# Altium project RT5621 Main V3.2.PrjPcb
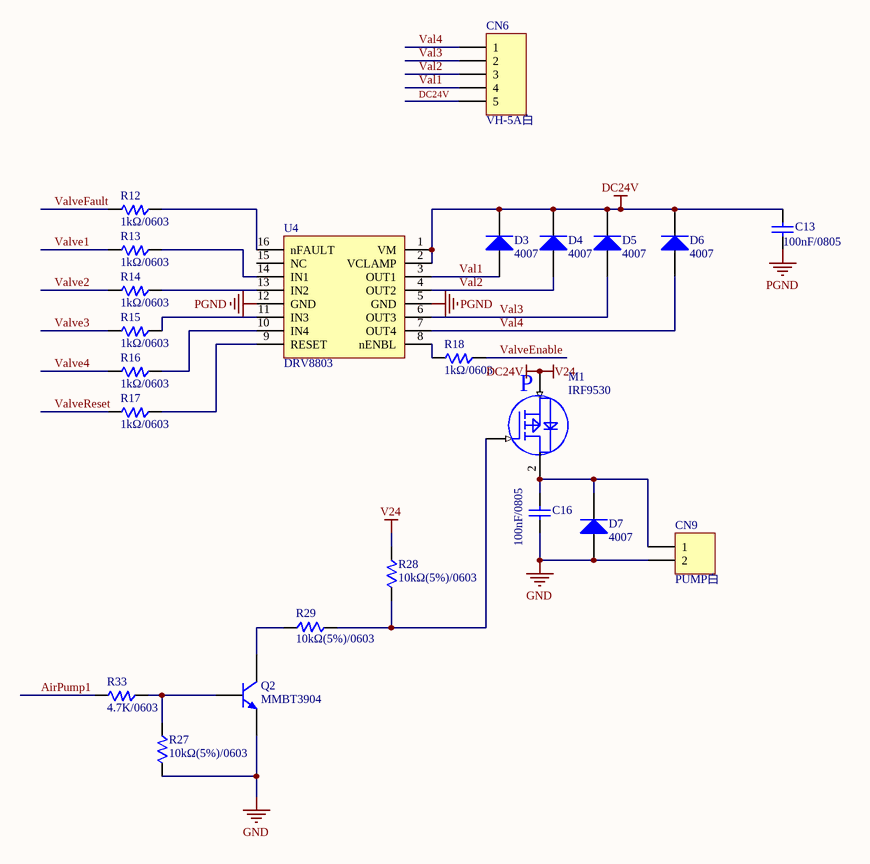
[diagram p0: RT-ValveX4+AirPump.SchDoc]
5 sheets, 130 parts. Net scope: global (net labels, ports and power ports of the same name join across sheets).
Board file: RT5621 Main V3.3.PcbDoc
Sheets:
  RT-ValveX4+AirPump.SchDoc
  RT-HOT.SchDoc
  Motor.SchDoc
  RT-TI DC-DC 5V-LMR14030.SchDoc
  RT5621 Main V3.3.SchDoc

## Sheet RT-ValveX4+AirPump.SchDoc
size A4

### Parts
C13  100nF/0805  [0805C]
C16  100nF/0805  [0805C]
CN6  VH-5A白  [CON-VH-5P]
CN9  PUMP白  [CON-VH-2P]
D3  4007  [DO-214AC]
D4  4007  [DO-214AC]
D5  4007  [DO-214AC]
D6  4007  [DO-214AC]
D7  4007  [DO-214AC]
M1  IRF9530  [TO-220AB]
Q2  MMBT3904  [SOT-23-N]
R12  1kΩ/0603  [0603]
R13  1kΩ/0603  [0603]
R14  1kΩ/0603  [0603]
R15  1kΩ/0603  [0603]
R16  1kΩ/0603  [0603]
R17  1kΩ/0603  [0603]
R18  1kΩ/0603  [0603]
R27  10kΩ(5%)/0603  [0603]
R28  10kΩ(5%)/0603  [0603]
R29  10kΩ(5%)/0603  [0603]
R33  4.7K/0603  [0603]
U4  DRV8803  [PWP16]

### Nets
DC24V: C13.2 CN6.5 D3.2(K) D4.2(K) D5.2(K) D6.2(K) M1.3(D) R28.2 U4.1(VM) U4.2(VCLAMP)  [also labelled V24]
GND: C13.1 C16.1 CN9.2 D7.1(A) Q2.E R27.1 U4.5(GND) U4.12(GND)  [also labelled PGND]
AirPump1: R33.1
Val1: CN6.4 D3.1(A) U4.3(OUT1)
Val2: CN6.3 D4.1(A) U4.4(OUT2)
Val3: CN6.2 D5.1(A) U4.6(OUT3)
Val4: CN6.1 D6.1(A) U4.7(OUT4)
Valve1: R13.1
Valve2: R14.1
Valve3: R15.1
Valve4: R16.1
ValveEnable: R18.2
ValveFault: R12.1
ValveReset: R17.1
NetC16_2: C16.2 CN9.1 D7.2(K) M1.2(S)
NetM1_1: M1.1(G) R28.1 R29.1
NetQ2_B: Q2.B R27.2 R33.2
NetQ2_C: Q2.C R29.2
NetR12_2: R12.2 U4.16(nFAULT)
NetR13_2: R13.2 U4.14(IN1)
NetR14_2: R14.2 U4.13(IN2)
NetR15_2: R15.2 U4.11(IN3)
NetR16_2: R16.2 U4.10(IN4)
NetR17_2: R17.2 U4.9(RESET)
NetR18_1: R18.1 U4.8(nENBL)

Not connected (* = marked no-connect by the designer): U4 15(NC)

### Notes on the sheet
- 上海荣泰健康科技股份有限公司
- 设计
- 评审
- 审核
- 版本
- 日期
- (in symbol MP-IRF9530/环保) P

### Library data of the parts
C13 C16 = C0805/104M: 物料名称: 贴片电容104M/50V/0805封装/20%/X7R/环保; 物料编号: 1.01.25.003; 领料单位: 电子车间; 单位: 个; 仓库/库位: 内5X
CN6 = CON-VH-5A(白色): 物料名称: 大直脚VH-5A(白色)/环保; 物料编号: 1.01.57.524; 领料单位: 电子车间; 单位: 个; 仓库/库位: 内5X
CN9 = CON-VH-2A(白色): 物料名称: 大直脚VH-2A(白色)/环保; 物料编号: 1.01.57.500; 领料单位: 电子车间; 单位: 个; 仓库/库位: 内5X
D3-D7 = D4007/M7: 物料名称: 贴片二极管M7A/A-SMA封装/环保; 物料编号: 1.01.33.005; 领料单位: 电子车间; 单位: 个; 仓库/库位: 内5X
M1 = MP-IRF9530/环保: 物料名称: 场效应管(MOS管)IRF9530/环保; 物料编号: 1.01.40.003; 领料单位: 电子车间; 单位: 个; 仓库/库位: 内5X
Q2 = Q-MMBT3904/1AM-N: 物料名称: 贴片三极管1AM/MMBT3904/sot-23封装环保; 物料编号: 1.01.33.013; 领料单位: 电子车间; 单位: 个; 仓库/库位: 内5X
R12-R18 = R0603/1kΩ: 物料编号: 1.01.15.111; 物料名称: 贴片电阻1K/(5%)/0603封装/环保; 领料单位: 电子车间; 单位: 个; 仓库/库位: 内5X
R27-R29 = R0603/10kΩ/(5%): 物料编号: 1.01.15.105; 物料名称: 贴片电阻10kΩ/(5%)0603封装/环保; 领料单位: 个; 仓库/库位: 内5X
R33 = R0603/4.7K/(5%): 物料编号: 1.01.15.115; 物料名称: 贴片电阻4.7K/(5%)/0603封装/环保; 领料单位: 电子车间; 单位: 个; 仓库/库位: 内5X
U4 = IC-DRV8803: 物料名称: PWM输入4通道低侧驱动器DRV8803; 物料编号: 1.01.45.544; 领料单位: 电子车间; 单位: 个; 仓库/库位: 内5X

## Sheet RT-HOT.SchDoc
size A4
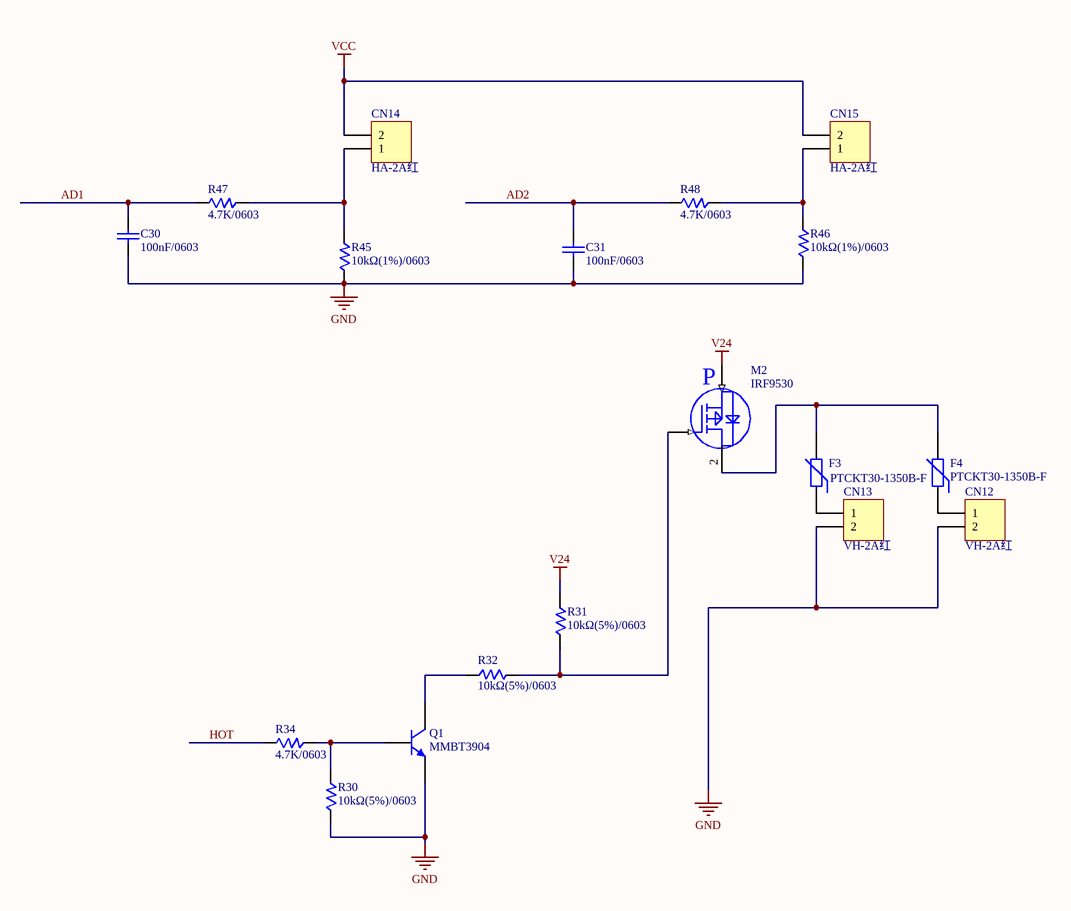
[diagram p1: RT-HOT.SchDoc]

### Parts
C30  100nF/0603  [0603C]
C31  100nF/0603  [0603C]
CN12  VH-2A红  [CON-VH-2P]
CN13  VH-2A红  [CON-VH-2P]
CN14  HA-2A红  [CON-XA-2P]
CN15  HA-2A红  [CON-XA-2P]
F3  PTCKT30-1350B-F  [FRAD0.2]
F4  PTCKT30-1350B-F  [FRAD0.2]
M2  IRF9530  [TO-220AB]
Q1  MMBT3904  [SOT-23-N]
R30  10kΩ(5%)/0603  [0603]
R31  10kΩ(5%)/0603  [0603]
R32  10kΩ(5%)/0603  [0603]
R34  4.7K/0603  [0603]
R45  10kΩ(1%)/0603  [0603]
R46  10kΩ(1%)/0603  [0603]
R47  4.7K/0603  [0603]
R48  4.7K/0603  [0603]

### Nets
GND: C30.2 C31.2 CN12.2 CN13.2 Q1.E R30.1 R45.1 R46.1
V24: M2.3(D) R31.2  [project net DC24V]
VCC: CN14.2 CN15.2
AD1: C30.1 R47.1
AD2: C31.1 R48.1
HOT: R34.1
NetCN12_1: CN12.1 F4.1
NetCN13_1: CN13.1 F3.1
NetCN14_1: CN14.1 R45.2 R47.2
NetCN15_1: CN15.1 R46.2 R48.2
NetF3_2: F3.2 F4.2 M2.2(S)
NetM2_1: M2.1(G) R31.1 R32.1
NetQ1_B: Q1.B R30.2 R34.2
NetQ1_C: Q1.C R32.2

### Notes on the sheet
- (in symbol MP-IRF9530/环保) P

### Library data of the parts
C30 C31 = C0603/100nF: 物料名称: 贴片电容104M/(20%)/X7R/0603封装/环保; 物料编号: 1.01.25.056; 领料单位: 电子车间; 单位: 个; 仓库/库位: 内5X
CN12 CN13 = CON-VH-2A(红色): 物料名称: 大直脚VH-2A(红色)/环保; 物料编号: 1.01.57.502; 领料单位: 电子车间; 单位: 个; 仓库/库位: 内5X
CN14 CN15 = CON-HA-2A(红色): 物料名称: 带勾小直角HA-2A(红色）/环保; 物料编号: 1.01.57.928; 领料单位: 电子车间; 单位: 个; 仓库/库位: 内5X
F3 F4 = F-PTCKT30-1350B-F/环保: 物料名称: 自恢复保险PTCKT30-1350b-F/环保; 物料编号: 1.01.38.609; 领料单位: 电子车间; 单位: 个; 仓库/库位: 内5X
M2 = MP-IRF9530/环保: as M1 on sheet RT-ValveX4+AirPump
Q1 = Q-MMBT3904/1AM-N: as Q2 on sheet RT-ValveX4+AirPump
R30-R32 = R0603/10kΩ/(5%): as R27 on sheet RT-ValveX4+AirPump
R34 R47 R48 = R0603/4.7K/(5%): as R33 on sheet RT-ValveX4+AirPump
R45 R46 = R0603/10kΩ(1%): 物料编号: 1.01.15.112; 物料名称: 贴片电阻10kΩ(1%)/0603封装/环保; 领料单位: 电子车间; 单位: 个; 仓库/库位: 内5X

## Sheet Motor.SchDoc
size A4
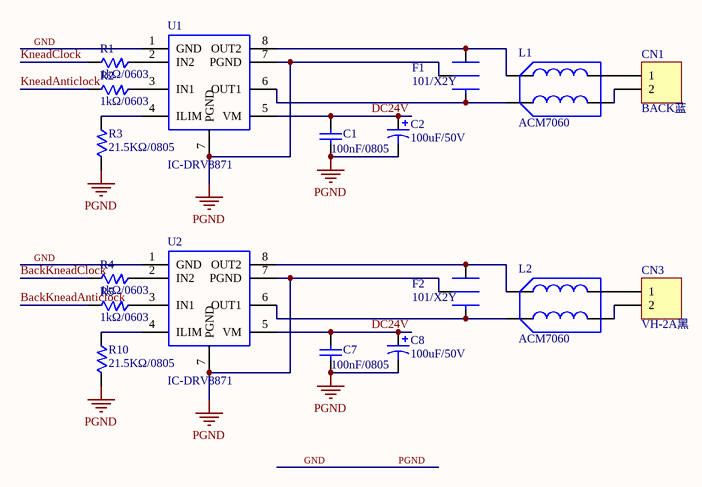
[diagram p2: Motor.SchDoc]

### Parts
C1  100nF/0805  [0805C]
C2  100uF/50V  [RB.15/.35]
C7  100nF/0805  [0805C]
C8  100uF/50V  [RB.15/.35]
CN1  BACK蓝  [CON-VH-2P]
CN3  VH-2A黑  [CON-VH-2P]
F1  101/X2Y  [X2Y]
F2  101/X2Y  [X2Y]
L1  ACM7060  [TLDCM7161]
L2  ACM7060  [TLDCM7161]
R1  1kΩ/0603  [0603]
R2  1kΩ/0603  [0603]
R3  21.5KΩ/0805  [0603]
R4  1kΩ/0603  [0603]
R5  1kΩ/0603  [0603]
R10  21.5KΩ/0805  [0603]
U1  IC-DRV8871  [DRV8871]
U2  IC-DRV8871  [DRV8871]

### Nets
DC24V: C1.2 C2.1 C7.2 C8.1 U1.5(VM) U2.5(VM)
GND: C1.1 C2.2 C7.1 C8.2 F1.3 F2.3 R3.1 R10.1 U1.1(GND) U1.7(PGND) U2.1(GND) U2.7(PGND)  [also labelled PGND]
BackKneadAnticlock: R5.1
BackKneadClock: R4.1
KneadAnticlock: R2.1
KneadClock: R1.1
NetCN1_1: CN1.1 L1.3
NetCN1_2: CN1.2 L1.4
NetCN3_1: CN3.1 L2.3
NetCN3_2: CN3.2 L2.4
NetF1_1: F1.1 L1.2 U1.8(OUT2)
NetF1_2: F1.2 L1.1 U1.6(OUT1)
NetF2_1: F2.1 L2.2 U2.8(OUT2)
NetF2_2: F2.2 L2.1 U2.6(OUT1)
NetR1_2: R1.2 U1.2(IN2)
NetR2_2: R2.2 U1.3(IN1)
NetR3_2: R3.2 U1.4(ILIM)
NetR4_2: R4.2 U2.2(IN2)
NetR5_2: R5.2 U2.3(IN1)
NetR10_2: R10.2 U2.4(ILIM)

### Notes on the sheet
- 上海荣泰健康科技股份有限公司
- 设计
- 评审
- 审核
- 版本
- 日期

### Library data of the parts
C1 C7 = C0805/104M: as C13 on sheet RT-ValveX4+AirPump
C2 C8 = CD/100uF/50V: 物料名称: 电解电容100uF/50V/8*11/编带/环保; 物料编号: 1.01.21.024; 领料单位: 电子车间; 单位: 个; 仓库/库位: 内5X
CN1 = CON-VH-2A(蓝色): 物料名称: 大直脚VH-2A(蓝色)/环保; 物料编号: 1.01.57.504; 领料单位: 电子车间; 单位: 个; 仓库/库位: 内5X
CN3 = CON-VH-2A(黑色): 物料名称: 大直脚VH-2A(黑色)/环保; 物料编号: 1.01.57.503; 领料单位: 电子车间; 单位: 个; 仓库/库位: 内5X
F1 F2 = CX2Y/101: 物料名称: X2Y电容/101X15W103MV4E/环保; 物料编号: 1.01.51.073; 领料单位: 电子车间; 单位: 个; 仓库/库位: 内5X
L1 L2 = L/ACM7060: 物料名称: 贴片共模电感/ACM7060-701-2PL-TL-01/7060封装/环保; 物料编号: 1.01.51.077; 领料单位: 电子车间; 单位: 个; 仓库/库位: 内5X
R1 R2 R4 R5 = R0603/1kΩ: as R12 on sheet RT-ValveX4+AirPump
R3 R10 = R0603/21.5KΩ 1%: 物料编号: 新物料; 物料名称: 贴片电阻21.5KΩ/0603封装/精度1%/环保; 领料单位: 电子车间; 仓库/库位: 内5X
U1 U2 = IC-DRV8871: 物料名称: 电机H型驱动芯片/DRV8871; 物料编号: 1.01.45.595; 领料单位: 电子车间; 单位: 个; 仓库/库位: 内5X

## Sheet RT-TI DC-DC 5V-LMR14030.SchDoc
size A4
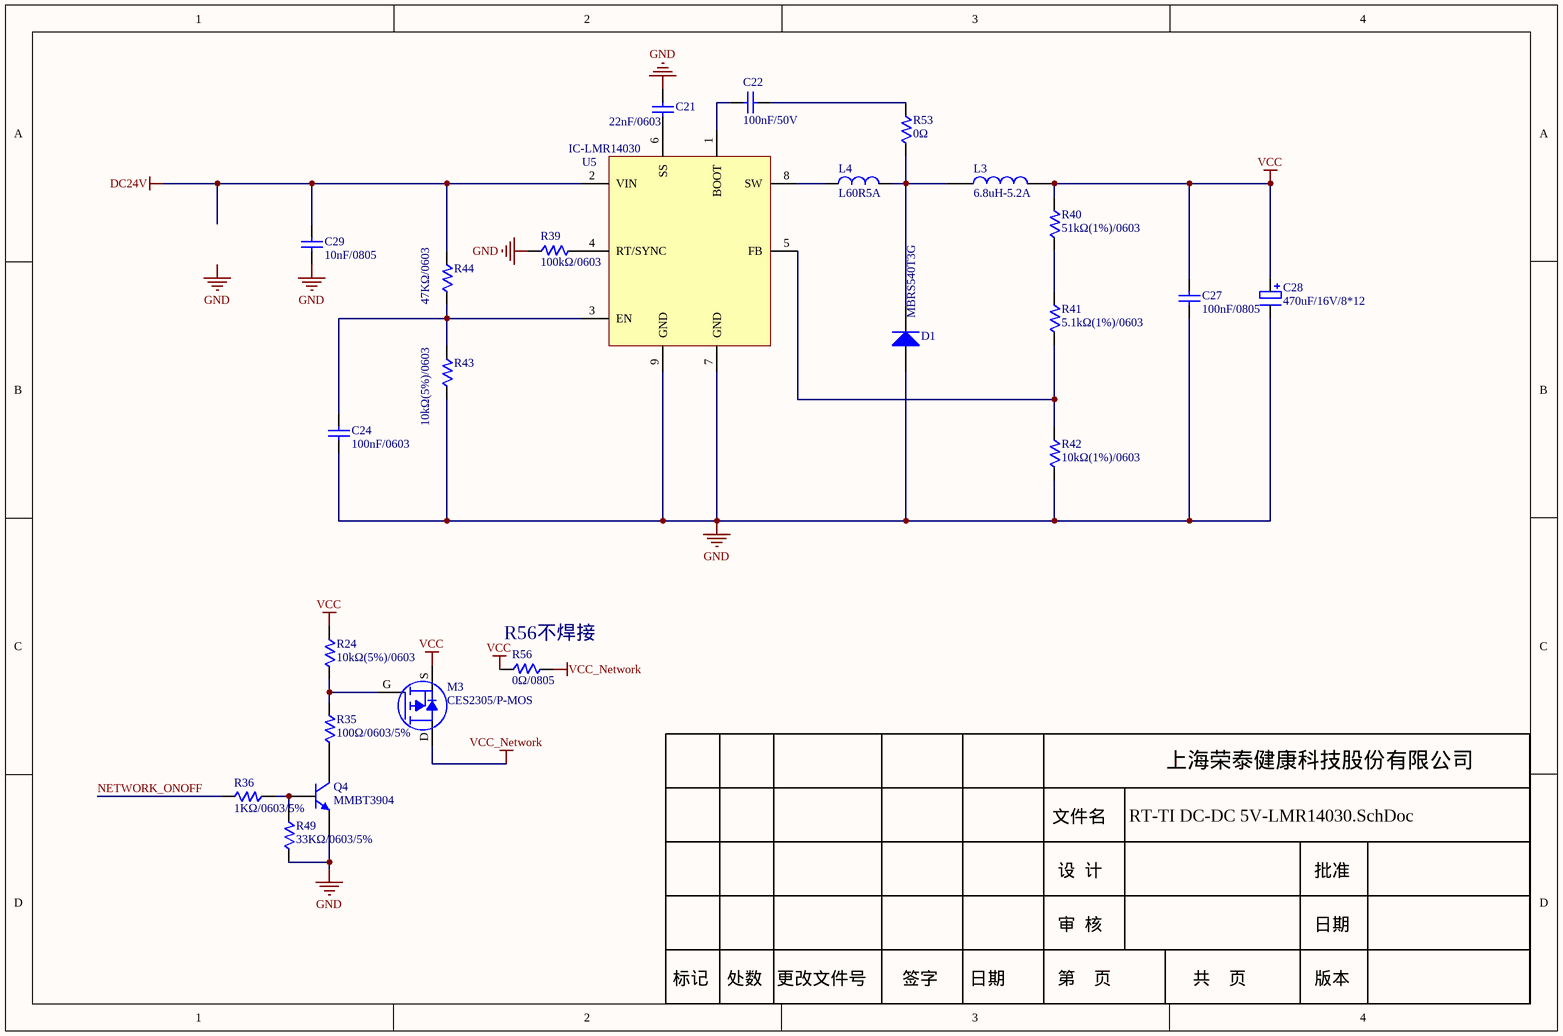
[diagram p3: RT-TI DC-DC 5V-LMR14030.SchDoc]

### Parts
(Parts that share a designator on the sheet are numbered #1, #2 ... from top to bottom, then left to right.)
C21  22nF/0603  [0603c]
C22  100nF/50V  [0603C]
C24  100nF/0603  [0603C]
C27  100nF/0805  [0805C]
C28  470uF/16V/8*12  [RB.15/.35]
C29  10nF/0805  [0805C]
D1  MBRS540T3G  [DO-214Ab]
L3  6.8uH-5.2A  [LH-11*11]
L4  L60R5A  [0805L]
M3  CES2305/P-MOS  [SOT-23C]
Q4  MMBT3904  [SOT-23-N]
R24  10kΩ(5%)/0603  [0603]
R35  100Ω/0603/5%  [0603]
R36  1KΩ/0603/5%  [0603]
R39  100kΩ/0603  [0603]
R40  51kΩ(1%)/0603  [0603]
R41  5.1kΩ(1%)/0603  [0603]
R42  10kΩ(1%)/0603  [0603]
R43  10kΩ(5%)/0603  [0603]
R44  47KΩ/0603  [0603]
R49#1  33KΩ/0603/5%  [0603]
R53  0Ω  [0603]
R56  0Ω/0805  [0805]  (no BOM)
U5  IC-LMR14030  [SO-8-2]

### Nets
DC24V: C29.1 R44.2 U5.2(VIN)
GND: C21.1 C24.1 C27.1 C28.2 C29.2 D1.1(A) Q4.E R39.2 R42.1 R43.1 R49#1.1 U5.7(GND) U5.9(GND)
VCC: C27.2 C28.1 L3.2 M3.S R24.2 R40.2 R56.2
VCC_Network: M3.D R56.1
NETWORK_ONOFF: R36.1
NetC21_2: C21.2 U5.6(SS)
NetC22_1: C22.1 U5.1(BOOT)
NetC22_2: C22.2 R53.2
NetC24_2: C24.2 R43.2 R44.1 U5.3(EN)
NetD1_2: D1.2(K) L3.1 L4.2 R53.1
NetL4_1: L4.1 U5.8(SW)
NetM3_G: M3.G R24.1 R35.2
NetQ4_B: Q4.B R36.2 R49#1.2
NetQ4_C: Q4.C R35.1
NetR39_1: R39.1 U5.4(RT/SYNC)
NetR40_1: R40.1 R41.2
NetR41_1: R41.1 R42.2 U5.5(FB)

### Notes on the sheet
- (near R56) R56不焊接
- Labels drawn without touching a wire or pin: GND
- 上海荣泰健康科技股份有限公司
- 文件名
- 设  计
- 批准
- 标记
- 处数
- 更改文件号
- 签字
- 日期
- 审  核
- 第    页
- 共    页
- 版本

### Library data of the parts
C21 = C0603/22nF: 物料名称: 贴片电容22nF/(10%)/X7R/0603封装/环保; 物料编号: 1.01.25.052; 领料单位: 电子车间; 单位: 个; 仓库/库位: 内5X
C22 = C0603/100nF/50V: 物料名称: 贴片电容100nF/(10%)X7R/0603封装/环保; 物料编号: 1.01.25.068; 领料单位: 电子车间; 单位: 个; 仓库/库位: 内5X
C24 = C0603/100nF: as C30 on sheet RT-HOT
C27 = C0805/104M: as C13 on sheet RT-ValveX4+AirPump
C28 = 电解电容470uF/16V/8*12/编带/环保: 物料编号: 1.01.21.034; 领料单位: 电子车间; 单位: 个; 仓库/库位: 内5X; 物料名称: 电解电容470uF/16V/8*12/编带/环保
C29 = C0805/103/50V: 物料名称: 贴片电容103/50V/0805封装/10%/X7R/环保; 物料编号: 1.01.25.018; 领料单位: 电子车间; 单位: 个; 仓库/库位: 内5X
D1 = D-MBRS540T3G: 物料名称: 贴片二极管MBRS540T3G/5A 40V/ DO-214AB封装/环保; 物料编号: 新物料; 领料单位: 电子车间; 单位: 个; 仓库/库位: 内5X
L3 = L-6.8uH-5.2A/10*10/环保: 物料名称: 6.8uH-5.2A/贴片功率电感/10*10/环保; 物料编号: 新物料; 领料单位: 电子车间; 单位: 个; 仓库/库位: 内5X
L4 = L0603/60R5A: 物料名称: 贴片磁珠/FBMA-11-201209-600A50T/0805A封装/环保/EMC; 物料编号: 1.01.51.080; 领料单位: 电子车间; 单位: 个; 仓库/库位: 内5X
M3 = P沟道mos管CES2305封装SOT-23/环保: 物料编号: 1.01.40.512; 物料名称: P沟道mos管CES2305封装SOT-23/环保
Q4 = Q-MMBT3904/1AM-N: as Q2 on sheet RT-ValveX4+AirPump
R24 R43 = R0603/10kΩ/(5%): as R27 on sheet RT-ValveX4+AirPump
R35 = 贴片电阻100Ω/(5%)0603封装: 物料编号: 1.01.15.103; 领料单位: 电子车间; 仓库/库位: 内5X; 单位: 个; 物料名称: 贴片电阻100Ω/(5%)0603封装
R36 = 贴片电阻1K/(5%)/0603封装/环保: 物料编号: 1.01.15.111; 领料单位: 电子车间; 单位: 个; 仓库/库位: 内5X; 物料名称: 贴片电阻1K/(5%)/0603封装/环保
R39 = R0603/100K: 物料编号: 1.01.15.123; 物料名称: 贴片电阻100kΩ(1%)/0603封装/环保; 领料单位: 电子车间; 单位: 个; 仓库/库位: 内5X
R40 = R0603/51kΩ(1%): 物料编号: 新物料; 物料名称: 贴片电阻51kΩ(1%)/0603封装/环保; 领料单位: 电子车间; 单位: 个; 仓库/库位: 内5X
R41 = R0603/5.1kΩ(1%): 物料编号: 新物料; 物料名称: 贴片电阻5.1kΩ(1%)/0603封装/环保; 领料单位: 电子车间; 单位: 个; 仓库/库位: 内5X
R42 = R0603/10kΩ(1%): as R45 on sheet RT-HOT
R44 = R0603/47KΩ: 物料编号: 新物料; 物料名称: 贴片电阻47KΩ/0603封装/环保; 领料单位: 电子车间; 单位: 个; 仓库/库位: 内5X
R49#1 = 贴片电阻33K/(5%)/0603封装/环保: 物料编号: 1.01.15.117; 领料单位: 电子车间; 仓库/库位: 内5X; 单位: 个; 物料名称: 贴片电阻33K/(5%)/0603封装/环保
R53 = R0603/0Ω: 物料编号: 1.01.15.124; 物料名称: 贴片电阻0Ω/(5%)/0603封装/环保; 领料单位: 电子车间; 单位: 个; 仓库/库位: 内5X
R56 = 贴片电阻0Ω/0805封装/环保: 物料编号: 1.01.15.004; 领料单位: 电子车间; 仓库/库位: 内5X; 单位: 个; 物料名称: 贴片电阻0Ω/0805封装/环保
U5 = IC-LMR14030/SO-8: 物料名称: DC-DC降压芯片LMR14030/4V-40V-3.5A; 物料编号: 新物料; 领料单位: 电子车间; 单位: 个; 仓库/库位: 内5X

## Sheet RT5621 Main V3.3.SchDoc
size A4
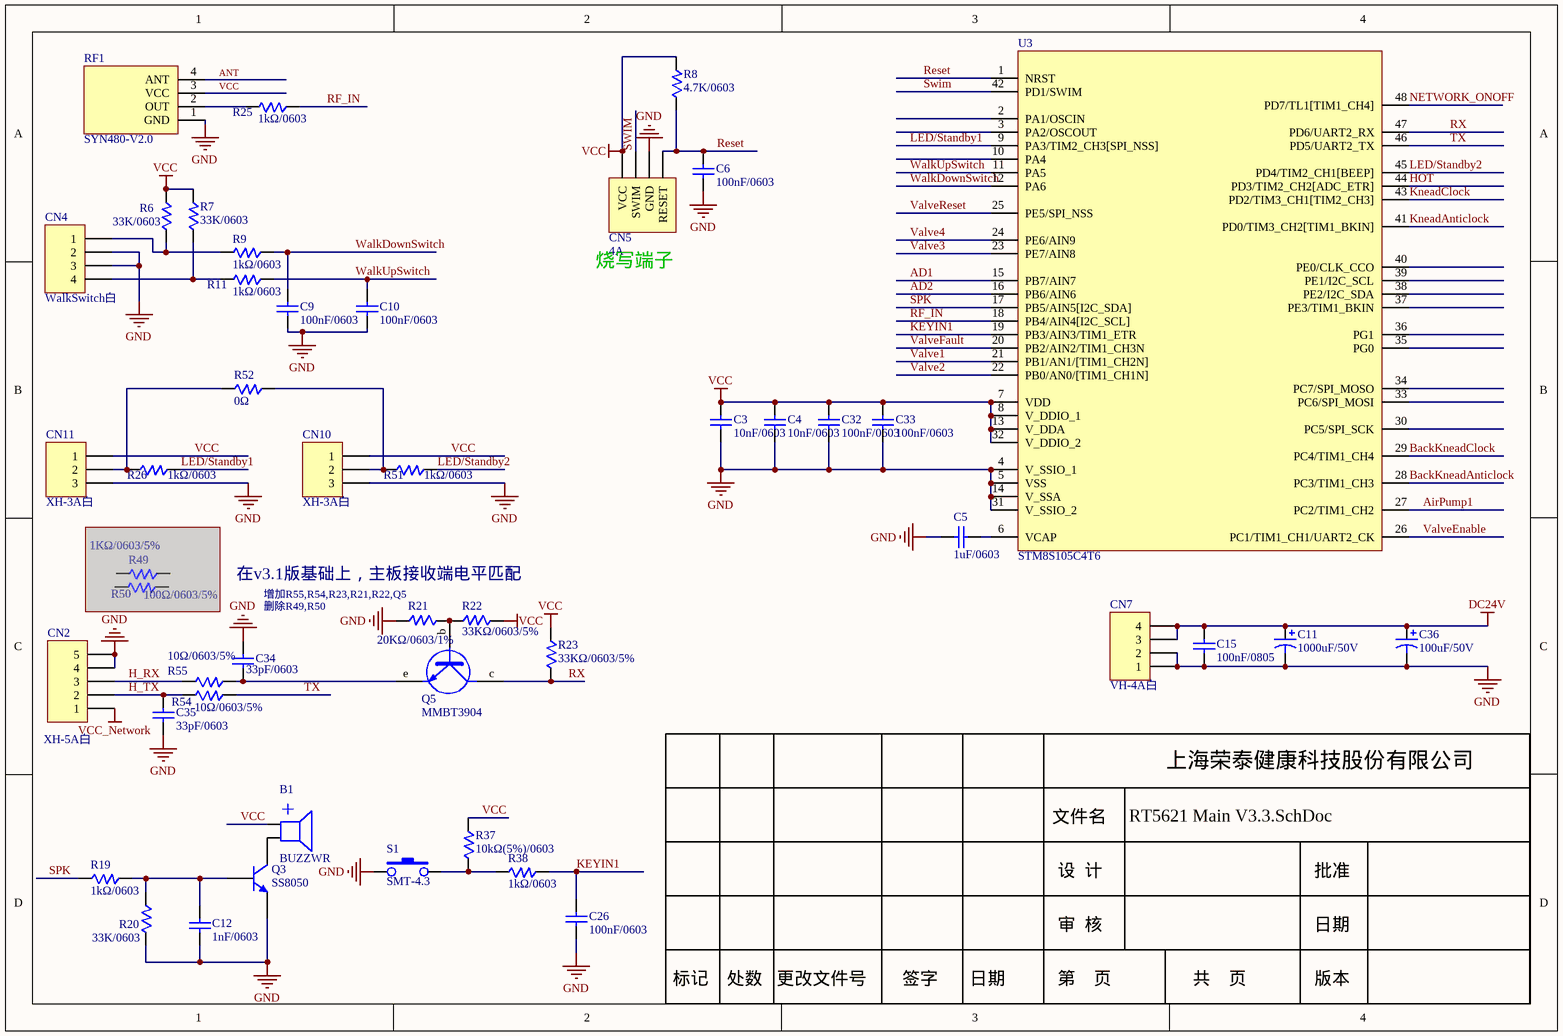
[diagram p4: RT5621 Main V3.3.SchDoc]

### Parts
(Parts that share a designator on the sheet are numbered #1, #2 ... from top to bottom, then left to right.)
B1  BUZZWR  [BUZZER]
C3  10nF/0603  [0603C]
C4  10nF/0603  [0603C]
C5  1uF/0603  [0603C]
C6  100nF/0603  [0603C]
C9  100nF/0603  [0603C]
C10  100nF/0603  [0603C]
C11  1000uF/50V  [CD16-7.5mm]
C12  1nF/0603  [0603C]
C15  100nF/0805  [0805C]
C26  100nF/0603  [0603C]
C32  100nF/0603  [0603C]
C33  100nF/0603  [0603C]
C34  33pF/0603  [0603C]
C35  33pF/0603  [0603C]
C36  100uF/50V  [RB.15/.35]
CN2  XH-5A白  [CON-XA-5P]
CN4  WalkSwitch白  [CON-XA-4P]
CN5  4A  [SIP4]
CN7  VH-4A白  [CON-VH-4P]
CN10  XH-3A白  [CON-XA-3P]
CN11  XH-3A白  [CON-XA-3P]
Q3  SS8050  [SOT-23]
Q5  MMBT3904  [SOT-23B]
R6  33K/0603  [0603]
R7  33K/0603  [0603]
R8  4.7K/0603  [0603]
R9  1kΩ/0603  [0603]
R11  1kΩ/0603  [0603]
R19  1kΩ/0603  [0603]
R20  33K/0603  [0603]
R21  20KΩ/0603/1%  [0603]
R22  33KΩ/0603/5%  [0603]
R23  33KΩ/0603/5%  [0603]
R25  1kΩ/0603  [0603]
R26  1kΩ/0603  [0603]
R37  10kΩ(5%)/0603  [0603]
R38  1kΩ/0603  [0603]
R49#2  1KΩ/0603/5%  [0603]  (masked out: inside a compile mask, not in the netlist)
R50  100Ω/0603/5%  [0603]  (masked out: inside a compile mask, not in the netlist)
R51  1kΩ/0603  [0603]
R52  0Ω  [0603]
R54  10Ω/0603/5%  [0603]
R55  10Ω/0603/5%  [0603]
RF1  SYN480-V2.0  [SYN480R-V2.0]
S1  SMT-4.3  [SMT-SWITCH4.3]
U3  STM8S105C4T6  [LQFP-48]

### Nets
DC24V: C11.1 C15.2 C36.1 CN7.3 CN7.4
GND: C3.1 C4.1 C5.2 C6.1 C9.2 C10.2 C11.2 C12.1 C15.1 C26.2 C32.2 C33.2 C34.2 C35.2 C36.2 CN2.4 CN2.5 CN4.2 CN4.3 CN5.3(GND) CN7.1 CN7.2 CN10.3 CN11.3 Q3.E R20.1 R21.2 RF1.1(GND) S1.1 U3.4(V_SSIO_1) U3.5(VSS) U3.14(V_SSA) U3.31(V_SSIO_2)
VCC: B1.1 C3.2 C4.2 C32.1 C33.1 CN5.1(VCC) CN10.1 CN11.1 R6.2 R7.2 R8.2 R22.1 R23.2 R37.2 RF1.3(VCC) U3.7(VDD) U3.8(V_DDIO_1) U3.13(V_DDA) U3.32(V_DDIO_2)
VCC_Network: CN2.1
AD1: U3.15(PB7/AIN7)
AD2: U3.16(PB6/AIN6)
AirPump1: U3.27(PC2/TIM1_CH2)
ANT: RF1.4(ANT)
BackKneadAnticlock: U3.28(PC3/TIM1_CH3)
BackKneadClock: U3.29(PC4/TIM1_CH4)
H_RX: CN2.3 R55.1
H_TX: C35.1 CN2.2 R54.1
HOT: U3.44(PD3/TIM2_CH2[ADC_ETR])
KEYIN1: C26.1 R38.2 U3.19(PB3/AIN3/TIM1_ETR)
KneadAnticlock: U3.41(PD0/TIM3_CH2[TIM1_BKIN])
KneadClock: U3.43(PD2/TIM3_CH1[TIM2_CH3])
LED/Standby1: R26.2 U3.9(PA3/TIM2_CH3[SPI_NSS])
LED/Standby2: R51.2 U3.45(PD4/TIM2_CH1[BEEP])
NETWORK_ONOFF: U3.48(PD7/TL1[TIM1_CH4])
Reset: C6.2 CN5.4(RESET) R8.1 U3.1(NRST)
RF_IN: R25.2 U3.18(PB4/AIN4[I2C_SCL])
RX: Q5.c R23.1 U3.47(PD6/UART2_RX)
SPK: R19.1 U3.17(PB5/AIN5[I2C_SDA])
SWIM: CN5.2(SWIM) U3.42(PD1/SWIM)
TX: R54.2 U3.46(PD5/UART2_TX)
Valve1: U3.21(PB1/AN1/[TIM1_CH2N])
Valve2: U3.22(PB0/AN0/[TIM1_CH1N])
Valve3: U3.23(PE7/AIN8)
Valve4: U3.24(PE6/AIN9)
ValveEnable: U3.26(PC1/TIM1_CH1/UART2_CK)
ValveFault: U3.20(PB2/AIN2/TIM1_CH3N)
ValveReset: U3.25(PE5/SPI_NSS)
WalkDownSwitch: C9.1 R9.2 U3.12(PA6)
WalkUpSwitch: C10.1 R11.2 U3.11(PA5)
NetB1_2: B1.2 Q3.C
NetC5_1: C5.1 U3.6(VCAP)
NetC12_2: C12.2 Q3.B R19.2 R20.2
NetC34_1: C34.1 Q5.e R55.2
NetCN4_1: CN4.1 R6.1 R9.1
NetCN4_4: CN4.4 R7.1 R11.1
NetCN10_2: CN10.2 R51.1 R52.2
NetCN11_2: CN11.2 R26.1 R52.1
NetQ5_b: Q5.b R21.1 R22.2
NetR25_1: R25.1 RF1.2(OUT)
NetR37_1: R37.1 R38.1 S1.2

Not connected (* = marked no-connect by the designer): U3 2(PA1/OSCIN) 3(PA2/OSCOUT) 10(PA4) 30(PC5/SPI_SCK) 33(PC6/SPI_MOSI) 34(PC7/SPI_MOSO) 35(PG0) 36(PG1) 37(PE3/TIM1_BKIN) 38(PE2/I2C_SDA) 39(PE1/I2C_SCL) 40(PE0/CLK_CCO)

### Notes on the sheet
- 烧写端子
- (near R21) 在v3.1版基础上，主板接收端电平匹配
- (near R21) 增加R55,R54,R23,R21,R22,Q5
- (near C34) 删除R49,R50
- 上海荣泰健康科技股份有限公司
- 文件名
- 设  计
- 批准
- 标记
- 处数
- 更改文件号
- 签字
- 日期
- 审  核
- 第    页
- 共    页
- 版本
- (in symbol BUZZWR-5V) +

### Library data of the parts
B1 = BUZZWR-5V: 物料编号: 1.01.56.002; 物料名称: 蜂鸣器5V有源(超薄)环保; 领料单位: 电子车间; 单位: 个; 仓库/库位: 内5X
C3 C4 = C0603/10nF: 物料名称: 贴片电容10nF/(10%)X7R/0603封装/环保; 领料单位: 电子车间; 单位: 个; 仓库/库位: 内5X
C5 = C0603/105M: 物料名称: 贴片电容105M/（20%）0603封装/环保; 物料编号: 1.01.25.060; 领料单位: 电子车间; 单位: 个; 仓库/库位: 内5X
C6 C9 C10 C26 C32 C33 = C0603/100nF: as C30 on sheet RT-HOT
C11 = CD-1000uF/50V/16*26: 物料名称: 电解电容1000uF/50V/16*26/环保; 物料编号: 1.01.21.042; 领料单位: 电子车间; 单位: 个; 仓库/库位: 内5X
C12 = C0603/1nF: 物料名称: 贴片电容102/(20%)/0603封装/环保; 物料编号: 1.01.25.061; 领料单位: 电子车间; 单位: 个; 仓库/库位: 内5X
C15 = C0805/104M: as C13 on sheet RT-ValveX4+AirPump
C34 C35 = C0603/33PF: 物料名称: 贴片电容33PF(5%)/C0G/0603封装/环保; 物料编号: 1.01.25.046; 领料单位: 电子车间; 单位: 个; 仓库/库位: 内5X
C36 = CD/100uF/50V: as C2 on sheet Motor
CN2 = CON-HA-5A(白色): 物料名称: 小直角HA-5A/白色/带钩/环保; 物料编号: 1.01.57.876; 领料单位: 电子车间; 单位: 个; 仓库/库位: 内5X
CN4 = CON-HA-4A(白色): 物料名称: 带勾小直脚HA-4A(白色)/环保; 物料编号: 1.01.57.884; 领料单位: 电子车间; 单位: 个; 仓库/库位: 内5X
CN5 = CON-4A: 物料名称: 单排4芯直脚排针/2.54间距; 物料编号: 1.01.58.024; 领料单位: 电子车间; 单位: 个; 仓库/库位: 内5X
CN7 = CON-VH-4A(白色): 物料名称: 大直脚VH-4A(白色)/环保; 物料编号: 1.01.57.517; 领料单位: 电子车间; 单位: 个; 仓库/库位: 内5X
CN10 CN11 = CON-HA-3A(白色): 物料名称: 带勾小直脚HA-3A (白色）/环保; 物料编号: 1.01.57.882; 领料单位: 电子车间; 单位: 个; 仓库/库位: 内5X
Q3 = Q-SS8050/SOYT-23封装/NPN/环保: 物料名称: 贴片三极管SS8050/SOYT-23封装/NPN/环保; 物料编号: 1.01.33.016; 领料单位: 电子车间; 单位: 个; 仓库/库位: 内5X
Q5 = 贴片三极管1AM/MMBT3904/sot-23封装环保: 物料编号: 1.01.33.013; 领料单位: 电子车间; 单位: 个; 仓库/库位: 内5X; 物料名称: 贴片三极管1AM/MMBT3904/sot-23封装环保
R6 R7 R20 = R0603/33K: 物料编号: 1.01.15.117; 物料名称: 贴片电阻33K/(5%)/0603封装/环保; 领料单位: 电子车间; 单位: 个; 仓库/库位: 内5X
R8 = R0603/4.7K/(5%): as R33 on sheet RT-ValveX4+AirPump
R9 R11 R19 R25 R26 R38 R51 = R0603/1kΩ: as R12 on sheet RT-ValveX4+AirPump
R21 = 贴片电阻20kΩ(1%)/0603封装/环保: 物料编号: 1.01.15.113; 领料单位: 电子车间; 单位: 个; 仓库/库位: 内5X; 物料名称: 贴片电阻20kΩ(1%)/0603封装/环保
R22 R23 = 贴片电阻33K/(5%)/0603封装/环保: 物料编号: 1.01.15.117; 领料单位: 电子车间; 单位: 个; 仓库/库位: 内5X; 物料名称: 贴片电阻33K/(5%)/0603封装/环保
R37 = R0603/10kΩ/(5%): as R27 on sheet RT-ValveX4+AirPump
R49#2 = 贴片电阻1K/(5%)/0603封装/环保: as R36 on sheet RT-TI DC-DC 5V-LMR14030; 物料名称: 贴片电阻1K/(5%)/0603封装/环保
R50 = 贴片电阻100Ω/(5%)0603封装: 物料编号: 1.01.15.103; 领料单位: 电子车间; 单位: 个; 仓库/库位: 内5X; 物料名称: 贴片电阻100Ω/(5%)0603封装
R52 = R0603/0Ω: as R53 on sheet RT-TI DC-DC 5V-LMR14030
R54 R55 = 贴片电阻10Ω/精度5%/0603封装/环保: 物料编号: 1.01.15.120; 领料单位: 电子车间; 单位: 个; 仓库/库位: 内5X; 物料名称: 贴片电阻10Ω/精度5%/0603封装/环保
RF1 = RF-315/433MH-V2.0: 物料名称: 315MHZ无线接收模块/SYN480; 物料编号: 4.2.0103307-1; 领料单位: 电子车间; 单位: 个; 仓库/库位: 内5X
S1 = SW-SMT-4.3mm: 物料编号: 1.01.52.604; 物料名称: 4.3mm贴片轻触按钮; 领料单位: 电子车间; 单位: 个; 仓库/库位: 内5X
U3 = IC-MCU-STM8S105C4T6: 物料名称: 单片机STM8S105C4T6/LQFP48/环保; 物料编号: 新物料; 领料单位: 电子车间; 单位: 个; 仓库/库位: 内5X

## Nets that join several sheets
DC24V: RT-ValveX4+AirPump (10 pins), RT-HOT (M2.3 R31.2), Motor (6 pins), RT-TI DC-DC 5V-LMR14030 (C29.1 R44.2 U5.2), RT5621 Main V3.3 (5 pins)
GND: RT-ValveX4+AirPump (8 pins), RT-HOT (8 pins), Motor (12 pins), RT-TI DC-DC 5V-LMR14030 (13 pins), RT5621 Main V3.3 (33 pins)
VCC: RT-HOT (CN14.2 CN15.2), RT-TI DC-DC 5V-LMR14030 (7 pins), RT5621 Main V3.3 (19 pins)
VCC_Network: RT-TI DC-DC 5V-LMR14030 (M3.D R56.1), RT5621 Main V3.3 (CN2.1)
AD1: RT-HOT (C30.1 R47.1), RT5621 Main V3.3 (U3.15)
AD2: RT-HOT (C31.1 R48.1), RT5621 Main V3.3 (U3.16)
AirPump1: RT-ValveX4+AirPump (R33.1), RT5621 Main V3.3 (U3.27)
BackKneadAnticlock: Motor (R5.1), RT5621 Main V3.3 (U3.28)
BackKneadClock: Motor (R4.1), RT5621 Main V3.3 (U3.29)
HOT: RT-HOT (R34.1), RT5621 Main V3.3 (U3.44)
KneadAnticlock: Motor (R2.1), RT5621 Main V3.3 (U3.41)
KneadClock: Motor (R1.1), RT5621 Main V3.3 (U3.43)
NETWORK_ONOFF: RT-TI DC-DC 5V-LMR14030 (R36.1), RT5621 Main V3.3 (U3.48)
Valve1: RT-ValveX4+AirPump (R13.1), RT5621 Main V3.3 (U3.21)
Valve2: RT-ValveX4+AirPump (R14.1), RT5621 Main V3.3 (U3.22)
Valve3: RT-ValveX4+AirPump (R15.1), RT5621 Main V3.3 (U3.23)
Valve4: RT-ValveX4+AirPump (R16.1), RT5621 Main V3.3 (U3.24)
ValveEnable: RT-ValveX4+AirPump (R18.2), RT5621 Main V3.3 (U3.26)
ValveFault: RT-ValveX4+AirPump (R12.1), RT5621 Main V3.3 (U3.20)
ValveReset: RT-ValveX4+AirPump (R17.1), RT5621 Main V3.3 (U3.25)